# EAGLE design fullpcb (EAGLE 8.0.1)
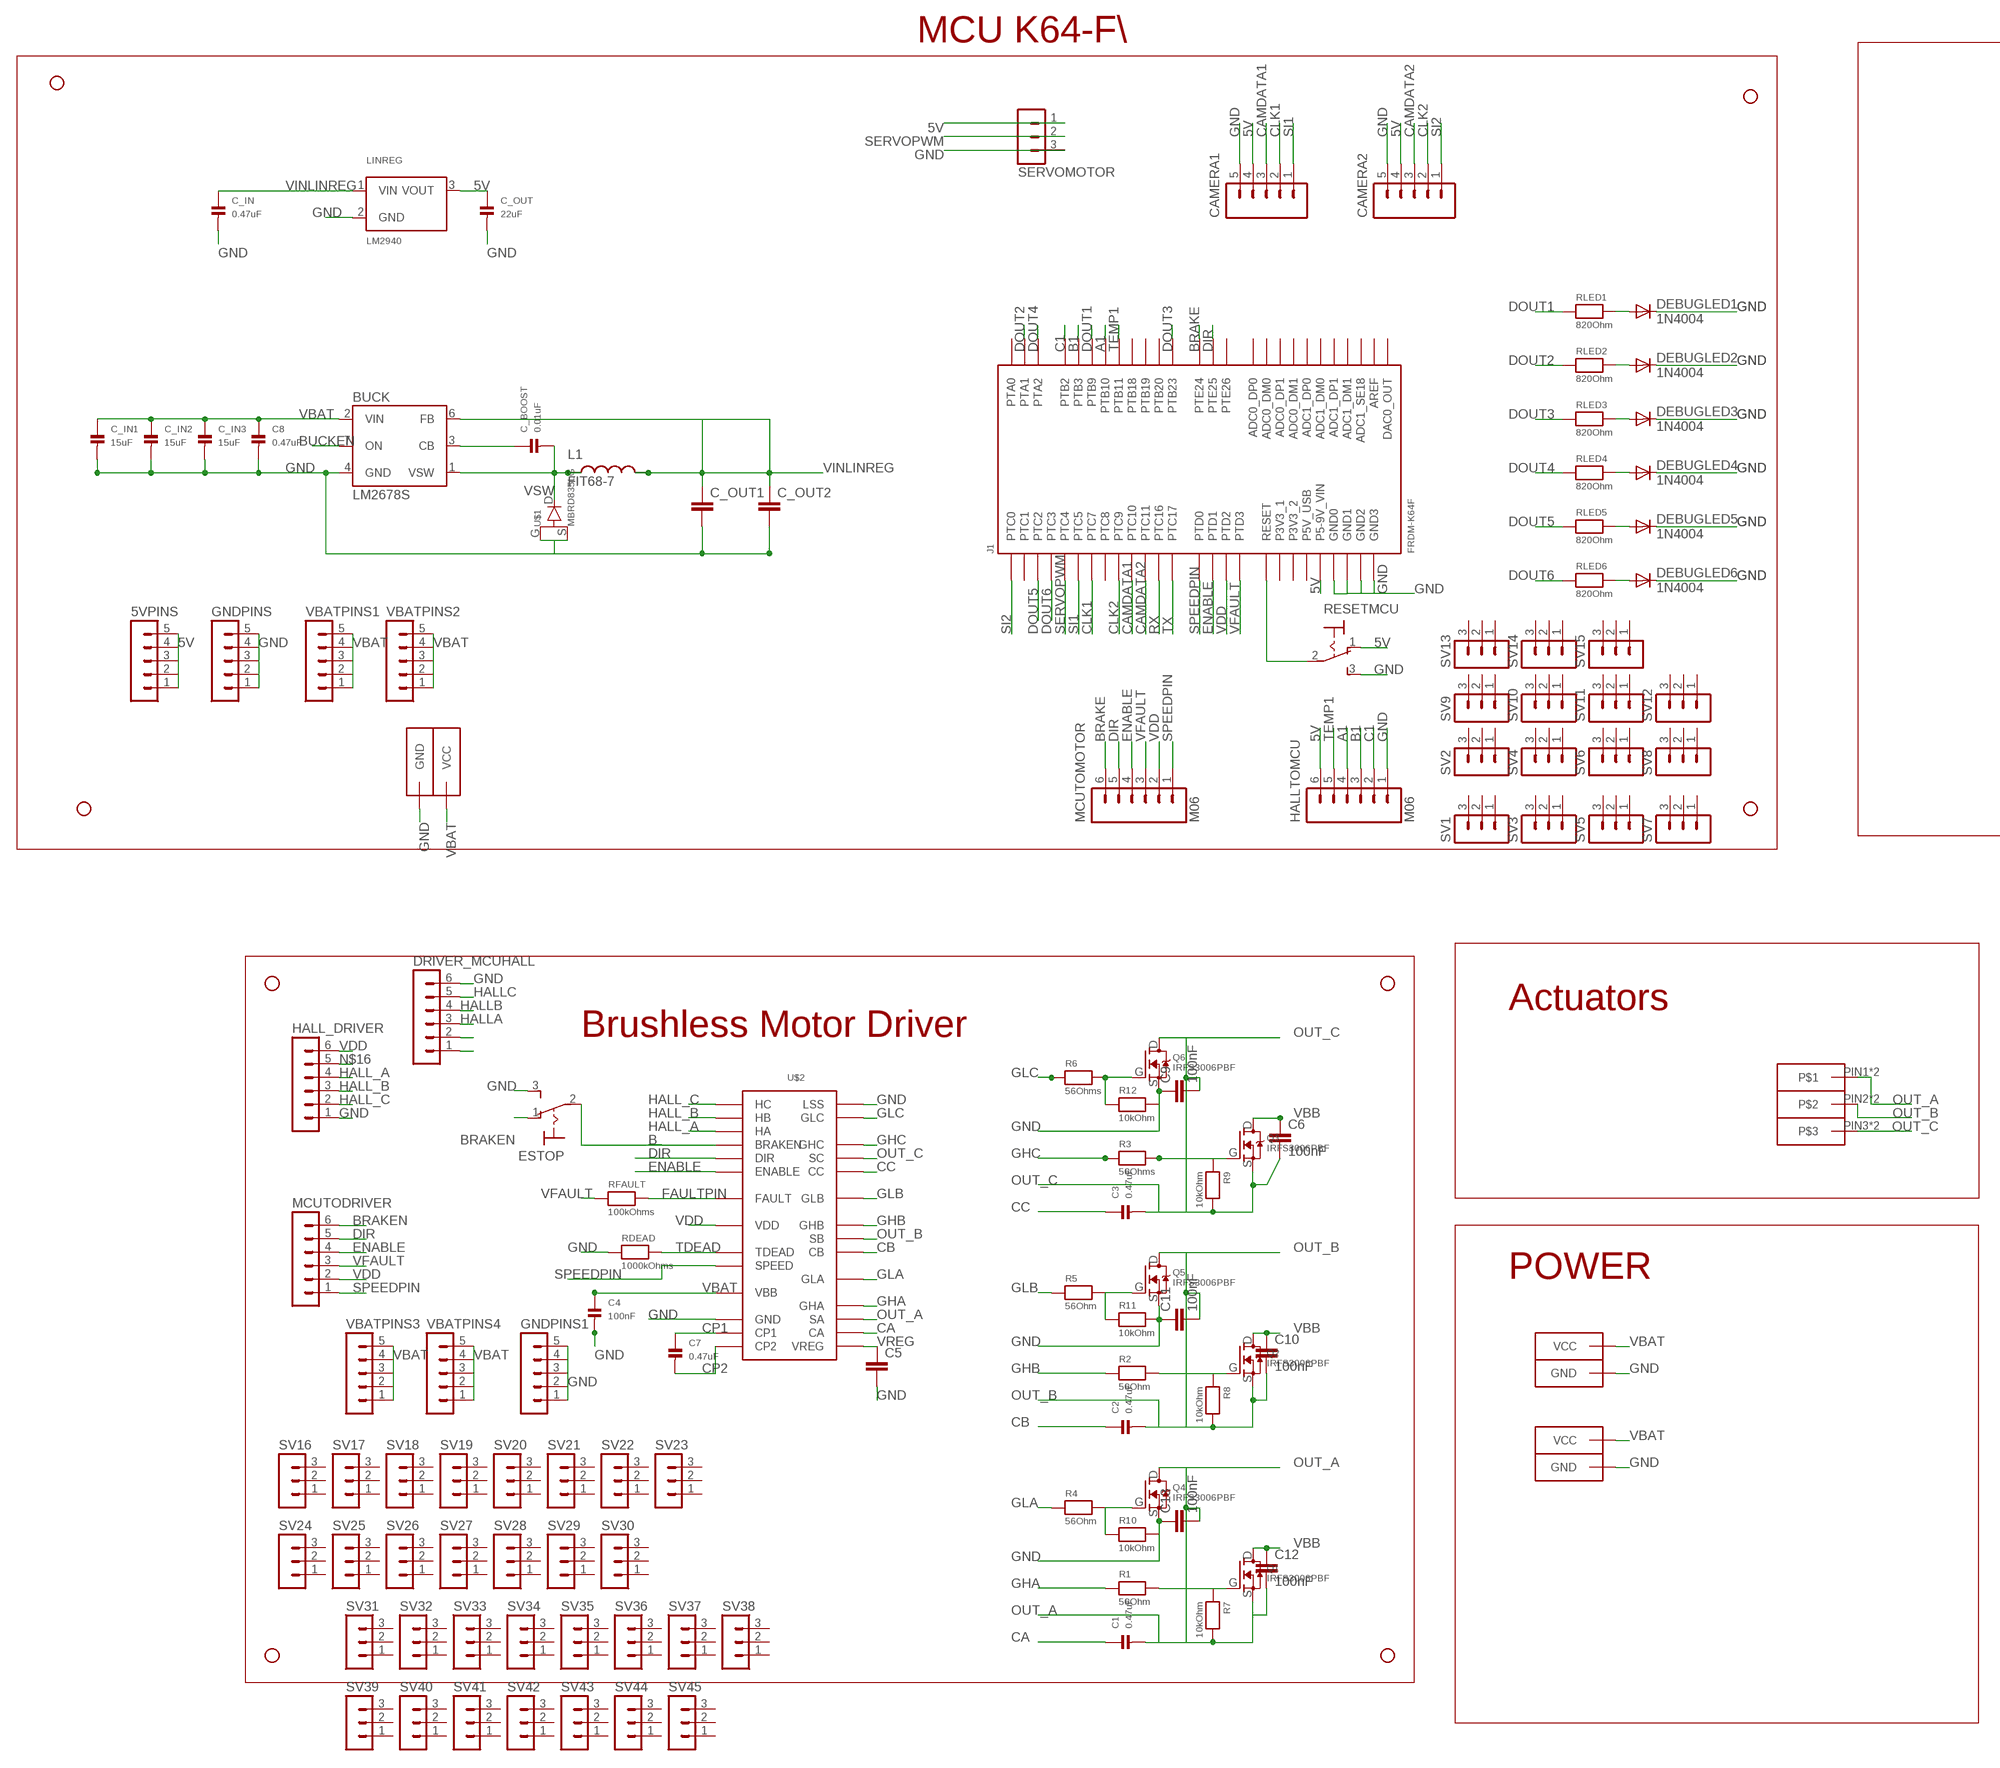
[diagram p0: schematic, sheet 1, part 1 of 2]
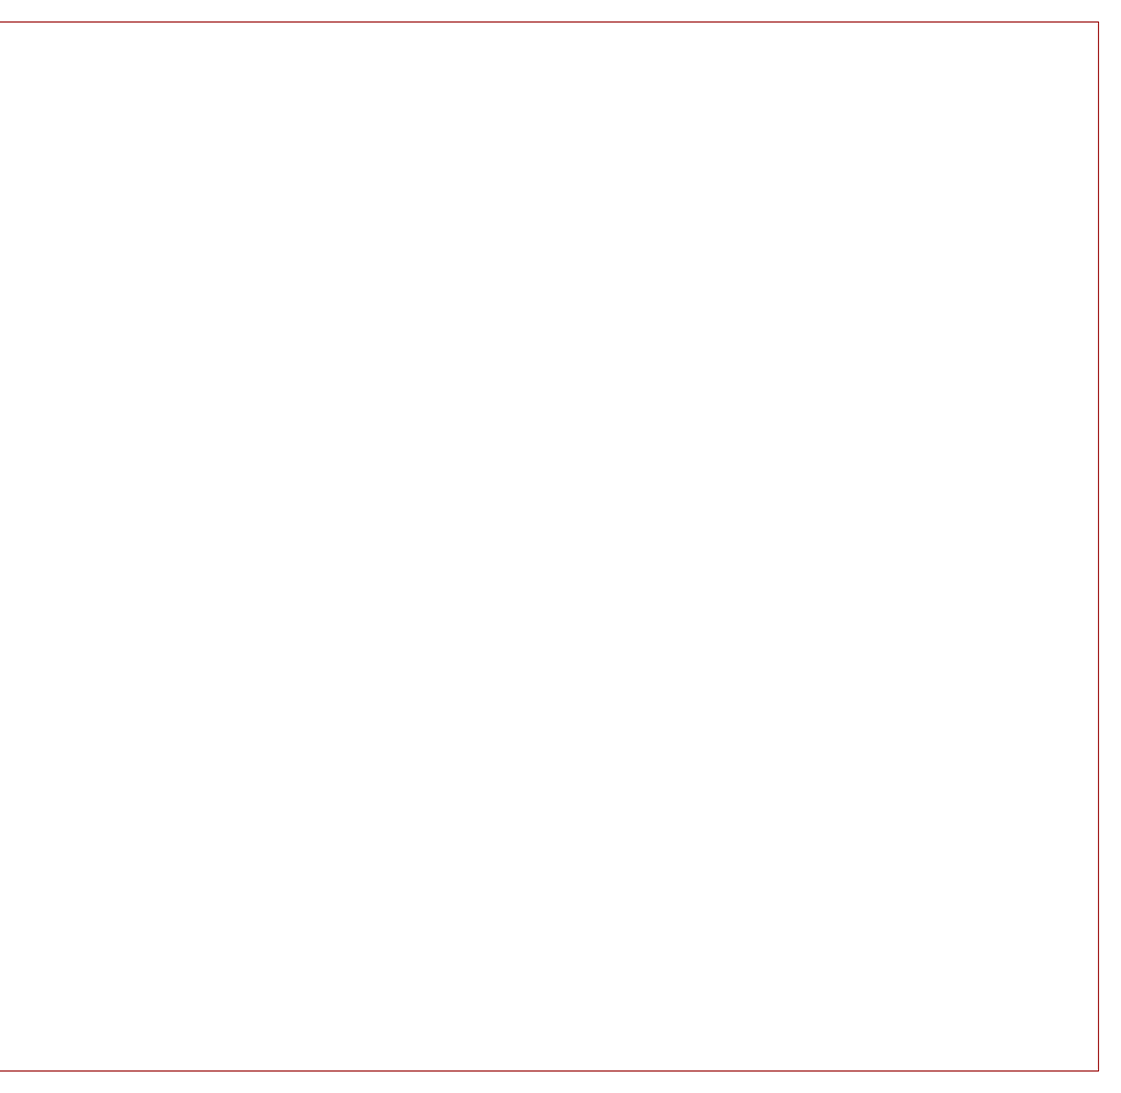
[diagram p1: schematic, sheet 1, part 2 of 2]

## Parts
5VPINS  MA05-1  [MA05-1]
BOARD2BOARD  ANDERSON_PP_DOUBLEHORIZONTAL  [ANDERSON_PP_DOUB_HORZ]
BUCK  LM2678S  [TO263-7]
C1  0.47uF  CAP_CERAMIC0805  [0805]
C2  0.47uF  CAP_CERAMIC0805  [0805]
C3  0.47uF  CAP_CERAMIC0805  [0805]
C4  100nF  CAP_CERAMIC0805  [0805]
C5  C2,5-3  [C2.5-3]
C6  100nF  C2,5-3  [C2.5-3]
C7  0.47uF  CAP_CERAMIC0805  [0805]
C8  0.47uF  CAP_CERAMIC0805  [0805]
C9  100nF  C2,5-3  [C2.5-3]
C10  100nF  C2,5-3  [C2.5-3]
C11  100nF  C2,5-3  [C2.5-3]
C12  100nF  C2,5-3  [C2.5-3]
C13  100nF  C2,5-3  [C2.5-3]
C_BOOST  0.01uF  CAP_CERAMIC0805  [0805]
C_IN  0.47uF  CAP_CERAMIC0805  [0805]
C_IN1  15uF  CAP_CERAMIC0805  [0805]
C_IN2  15uF  CAP_CERAMIC0805  [0805]
C_IN3  15uF  CAP_CERAMIC0805  [0805]
C_OUT  22uF  CAP_CERAMIC0805  [0805]
C_OUT1  C2,5-3  [C2.5-3]
C_OUT2  C2,5-3  [C2.5-3]
CAMERA1  M05PTH  [1X05]
CAMERA2  M05PTH  [1X05]
CONN1  ANDERSON_PP_DOUBLEHORIZONTAL  [ANDERSON_PP_DOUB_HORZ]
CONN2  ANDERSON_PP_DOUBLEHORIZONTAL  [ANDERSON_PP_DOUB_HORZ]
CONN3  ANDERSON_PP_TRIPHORIZ  [ANDERSON_PP_TRIP_HORZ]
DEBUGLED1  1N4004  [DO41-10]
DEBUGLED2  1N4004  [DO41-10]
DEBUGLED3  1N4004  [DO41-10]
DEBUGLED4  1N4004  [DO41-10]
DEBUGLED5  1N4004  [DO41-10]
DEBUGLED6  1N4004  [DO41-10]
DRIVER_MCUHALL  MA06-1  [MA06-1]
ESTOP  M9040P  [M9040P]
GNDPINS  MA05-1  [MA05-1]
GNDPINS1  MA05-1  [MA05-1]
HALL_DRIVER  MA06-1  [MA06-1]
HALLTOMCU  M06  [1X06-MTA]
J1  FRDM-K64F  [FRDM-K64F]
JP1  STAND-OFF  [STAND-OFF]
JP2  STAND-OFF  [STAND-OFF]
JP3  STAND-OFF  [STAND-OFF]
JP4  STAND-OFF  [STAND-OFF]
JP5  STAND-OFF  [STAND-OFF]
JP6  STAND-OFF  [STAND-OFF]
JP7  STAND-OFF  [STAND-OFF]
JP8  STAND-OFF  [STAND-OFF]
L1  FIT68-7  [FIT68-7]
LINREG  LM2940  [TO220V]
MCUTODRIVER  MA06-1  [MA06-1]
MCUTOMOTOR  M06  [1X06-MTA]
Q1  IRFS3006PBF  [IRFS3006PBF]
Q2  IRFS3006PBF  [IRFS3006PBF]
Q3  IRFS3006PBF  [IRFS3006PBF]
Q4  IRFS3006PBF  [IRFS3006PBF]
Q5  IRFS3006PBF  [IRFS3006PBF]
Q6  IRFS3006PBF  [IRFS3006PBF]
R1  56Ohm  RESISTOR0805  [0805]
R2  56Ohm  RESISTOR0805  [0805]
R3  56Ohms  RESISTOR0805  [0805]
R4  56Ohm  RESISTOR0805  [0805]
R5  56Ohm  RESISTOR0805  [0805]
R6  56Ohms  RESISTOR0805  [0805]
R7  10kOhm  RESISTOR0805  [0805]
R8  10kOhm  RESISTOR0805  [0805]
R9  10kOhm  RESISTOR0805  [0805]
R10  10kOhm  RESISTOR0805  [0805]
R11  10kOhm  RESISTOR0805  [0805]
R12  10kOhm  RESISTOR0805  [0805]
RDEAD  1000kOhms  RESISTOR0805  [0805]
RESETMCU  M9040P  [M9040P]
RFAULT  100kOhms  RESISTOR0805  [0805]
RLED1  820Ohm  RESISTOR0805  [0805]
RLED2  820Ohm  RESISTOR0805  [0805]
RLED3  820Ohm  RESISTOR0805  [0805]
RLED4  820Ohm  RESISTOR0805  [0805]
RLED5  820Ohm  RESISTOR0805  [0805]
RLED6  820Ohm  RESISTOR0805  [0805]
SERVOMOTOR  MA03-1  [MA03-1]
SV1  MA03-1  [MA03-1]
SV2  MA03-1  [MA03-1]
SV3  MA03-1  [MA03-1]
SV4  MA03-1  [MA03-1]
SV5  MA03-1  [MA03-1]
SV6  MA03-1  [MA03-1]
SV7  MA03-1  [MA03-1]
SV8  MA03-1  [MA03-1]
SV9  MA03-1  [MA03-1]
SV10  MA03-1  [MA03-1]
SV11  MA03-1  [MA03-1]
SV12  MA03-1  [MA03-1]
SV13  MA03-1  [MA03-1]
SV14  MA03-1  [MA03-1]
SV15  MA03-1  [MA03-1]
SV16  MA03-1  [MA03-1]
SV17  MA03-1  [MA03-1]
SV18  MA03-1  [MA03-1]
SV19  MA03-1  [MA03-1]
SV20  MA03-1  [MA03-1]
SV21  MA03-1  [MA03-1]
SV22  MA03-1  [MA03-1]
SV23  MA03-1  [MA03-1]
SV24  MA03-1  [MA03-1]
SV25  MA03-1  [MA03-1]
SV26  MA03-1  [MA03-1]
SV27  MA03-1  [MA03-1]
SV28  MA03-1  [MA03-1]
SV29  MA03-1  [MA03-1]
SV30  MA03-1  [MA03-1]
SV31  MA03-1  [MA03-1]
SV32  MA03-1  [MA03-1]
SV33  MA03-1  [MA03-1]
SV34  MA03-1  [MA03-1]
SV35  MA03-1  [MA03-1]
SV36  MA03-1  [MA03-1]
SV37  MA03-1  [MA03-1]
SV38  MA03-1  [MA03-1]
SV39  MA03-1  [MA03-1]
SV40  MA03-1  [MA03-1]
SV41  MA03-1  [MA03-1]
SV42  MA03-1  [MA03-1]
SV43  MA03-1  [MA03-1]
SV44  MA03-1  [MA03-1]
SV45  MA03-1  [MA03-1]
U$1  MBRD835LG  [DPACK_2]
U$2  A4915SOCKET  [DIL28-6]
VBATPINS1  MA05-1  [MA05-1]
VBATPINS2  MA05-1  [MA05-1]
VBATPINS3  MA05-1  [MA05-1]
VBATPINS4  MA05-1  [MA05-1]

## Nets
5V: 5VPINS.1 5VPINS.5 C_OUT.1 CAMERA1.4 CAMERA2.4 HALLTOMCU.6 J1.J3-16(P5-9V_VIN) LINREG.3(VOUT) RESETMCU.1(O) SERVOMOTOR.1
A1: HALLTOMCU.4 J1.J4-6(PTB10)
B1: HALLTOMCU.3 J1.J4-4(PTB3)
BRAKE: J1.J2-20(PTE24) MCUTOMOTOR.6
BRAKE1: ESTOP.2(P) U$2.25(BRAKEN)
BRAKEN: ESTOP.1(O) MCUTODRIVER.6
BUCKEN: BUCK.7(ON)
C1: HALLTOMCU.2 J1.J4-2(PTB2)
CA: C1.1 U$2.13(CA)
CAMDATA1: CAMERA1.3 J1.J4-12(PTC10)
CAMDATA2: CAMERA2.3 J1.J4-10(PTC11)
CB: BUCK.3(CB) C2.1 C_BOOST.1 U$2.9(CB)
CC: C3.1 U$2.5(CC)
CLK1: CAMERA1.2 J1.J1-13(PTC7)
CLK2: CAMERA2.2 J1.J1-9(PTC9)
CP1: C7.1 U$2.16(CP1)
CP2: C7.2 U$2.15(CP2)
DIR: J1.J2-18(PTE25) MCUTODRIVER.5 MCUTOMOTOR.5 U$2.24(DIR)
DOUT1: J1.J1-6(PTB9) RLED1.1
DOUT2: J1.J1-8(PTA1) RLED2.1
DOUT3: J1.J1-10(PTB23) RLED3.1
DOUT4: J1.J1-12(PTA2) RLED4.1
DOUT5: J1.J1-14(PTC2) RLED5.1
DOUT6: J1.J1-16(PTC3) RLED6.1
ENABLE: J1.J2-12(PTD1) MCUTODRIVER.4 MCUTOMOTOR.4 U$2.23(ENABLE)
FAULTPIN: RFAULT.2 U$2.22(FAULT)
GHA: R1.1 U$2.11(GHA)
GHB: R2.1 U$2.7(GHB)
GHC: R3.1 U$2.3(GHC)
GLA: R4.1 U$2.10(GLA)
GLB: R5.1 U$2.6(GLB)
GLC: R6.1 U$2.2(GLC)
GND: BOARD2BOARD.PIN1(GND) BOARD2BOARD.PIN1-LEAD(GND) BUCK.4(GND) C4.2 C5.2 C8.2 C9.1 C11.1 C13.1 C_IN1.2 C_IN2.2 C_IN3.2 C_IN.2 C_OUT1.2 C_OUT2.2 C_OUT.2 CAMERA1.5 CAMERA2.5 CONN1.PIN1(GND) CONN1.PIN1-LEAD(GND) CONN2.PIN1(GND) CONN2.PIN1-LEAD(GND) DEBUGLED1.C DEBUGLED2.C DEBUGLED3.C DEBUGLED4.C DEBUGLED5.C DEBUGLED6.C DRIVER_MCUHALL.6 ESTOP.3(S) GNDPINS1.1 GNDPINS1.5 GNDPINS.1 GNDPINS.5 HALL_DRIVER.1 HALLTOMCU.1 J1.J2-3(GND0) J1.J2-14(GND1) J1.J3-12(GND2) J1.J3-14(GND3) LINREG.2(GND) Q4.S Q5.S Q6.S R10.2 R11.2 R12.2 RESETMCU.3(S) SERVOMOTOR.3 U$1.G U$1.S U$2.1(LSS) U$2.17(GND)
HALL_A: HALL_DRIVER.4 U$2.26(HA)
HALL_B: HALL_DRIVER.3 U$2.27(HB)
HALL_C: HALL_DRIVER.2 U$2.28(HC)
HALLA: DRIVER_MCUHALL.3
HALLB: DRIVER_MCUHALL.4
HALLC: DRIVER_MCUHALL.5
N$1: DEBUGLED2.A RLED2.2
N$2: DEBUGLED3.A RLED3.2
N$3: DEBUGLED4.A RLED4.2
N$4: DEBUGLED5.A RLED5.2
N$5: DEBUGLED6.A RLED6.2
N$6: J1.J3-6(RESET) RESETMCU.2(P)
N$7: DEBUGLED1.A RLED1.2
N$8: Q1.G R1.2 R7.1
N$9: Q4.G R4.2 R10.1
N$11: Q2.G R2.2 R8.1
N$12: Q5.G R5.2 R11.1
N$14: Q6.G R6.2 R12.1
N$15: Q3.G R3.2 R9.1
N$16: HALL_DRIVER.5
N$25: DRIVER_MCUHALL.2
N$26: DRIVER_MCUHALL.1
OUT_A: C1.2 C12.2 C13.2 CONN3.PIN1 CONN3.PIN1-LEAD Q1.S Q4.D R7.2 U$2.12(SA)
OUT_B: C2.2 C10.2 C11.2 CONN3.PIN2 CONN3.PIN2-LEAD Q2.S Q5.D R8.2 U$2.8(SB)
OUT_C: C3.2 C6.2 C9.2 CONN3.PIN3 CONN3.PIN3-LEAD Q3.S Q6.D R9.2 U$2.4(SC)
RX: J1.J1-2(PTC16)
SERVOPWM: J1.J2-4(PTC4) SERVOMOTOR.2
SI1: CAMERA1.1 J1.J1-15(PTC5)
SI2: CAMERA2.1 J1.J1-11(PTC0)
SPEEDPIN: J1.J2-6(PTD0) MCUTODRIVER.1 MCUTOMOTOR.1 U$2.19(SPEED)
TDEAD: U$2.20(TDEAD)
TEMP1: HALLTOMCU.5 J1.J4-8(PTB11)
TX: J1.J1-4(PTC17)
VBAT: BOARD2BOARD.PIN2(VCC) BOARD2BOARD.PIN2-LEAD(VCC) BUCK.2(VIN) C4.1 C8.1 C_IN1.1 C_IN2.1 C_IN3.1 CONN1.PIN2(VCC) CONN1.PIN2-LEAD(VCC) CONN2.PIN2(VCC) CONN2.PIN2-LEAD(VCC) U$2.18(VBB) VBATPINS1.1 VBATPINS1.5 VBATPINS2.1 VBATPINS2.5 VBATPINS3.1 VBATPINS3.5 VBATPINS4.1 VBATPINS4.5
VBB: C6.1 C10.1 C12.1 Q1.D Q2.D Q3.D
VDD: HALL_DRIVER.6 J1.J2-8(PTD2) MCUTODRIVER.2 MCUTOMOTOR.2 U$2.21(VDD)
VFAULT: J1.J2-10(PTD3) MCUTODRIVER.3 MCUTOMOTOR.3 RFAULT.1
VINLINREG: BUCK.6(FB) C_IN.1 C_OUT1.1 C_OUT2.1 L1.P$2 LINREG.1(VIN)
VREG: C5.1 U$2.14(VREG)
VSW: BUCK.1(VSW) C_BOOST.2 L1.P$1
Unconnected: 5VPINS.2 5VPINS.3 5VPINS.4 GNDPINS1.2 GNDPINS1.3 GNDPINS1.4 GNDPINS.2 GNDPINS.3 GNDPINS.4 J1.J1-1(PTB18) J1.J1-3(PTB19) J1.J1-5(PTC1) J1.J1-7(PTC8) J1.J2-1(PTE26) J1.J2-2(PTA0) J1.J2-5(ADC0_DP0) J1.J2-7(ADC0_DM0) J1.J2-11(ADC1_DP0) J1.J2-13(ADC1_DM0) J1.J2-16(AREF) J1.J2-17(ADC1_SE18) J1.J3-4(P3V3_1) J1.J3-8(P3V3_2) J1.J3-10(P5V_USB) J1.J4-1(ADC0_DP1) J1.J4-3(ADC0_DM1) J1.J4-5(ADC1_DP1) J1.J4-7(ADC1_DM1) J1.J4-9(PTB20) J1.J4-11(DAC0_OUT) RDEAD.1 RDEAD.2 SV1.1 SV1.2 SV1.3 SV2.1 SV2.2 SV2.3 SV3.1 SV3.2 SV3.3 SV4.1 SV4.2 SV4.3 SV5.1 SV5.2 SV5.3 SV6.1 SV6.2 SV6.3 SV7.1 SV7.2 SV7.3 SV8.1 SV8.2 SV8.3 SV9.1 SV9.2 SV9.3 SV10.1 SV10.2 SV10.3 SV11.1 SV11.2 SV11.3 SV12.1 SV12.2 SV12.3 SV13.1 SV13.2 SV13.3 SV14.1 SV14.2 SV14.3 SV15.1 SV15.2 SV15.3 SV16.1 SV16.2 SV16.3 SV17.1 SV17.2 SV17.3 SV18.1 SV18.2 SV18.3 SV19.1 SV19.2 SV19.3 SV20.1 SV20.2 SV20.3 SV21.1 SV21.2 SV21.3 SV22.1 SV22.2 SV22.3 SV23.1 SV23.2 SV23.3 SV24.1 SV24.2 SV24.3 SV25.1 SV25.2 SV25.3 SV26.1 SV26.2 SV26.3 SV27.1 SV27.2 SV27.3 SV28.1 SV28.2 SV28.3 SV29.1 SV29.2 SV29.3 SV30.1 SV30.2 SV30.3 SV31.1 SV31.2 SV31.3 SV32.1 SV32.2 SV32.3 SV33.1 SV33.2 SV33.3 SV34.1 SV34.2 SV34.3 SV35.1 SV35.2 SV35.3 SV36.1 SV36.2 SV36.3 SV37.1 SV37.2 SV37.3 SV38.1 SV38.2 SV38.3 SV39.1 SV39.2 SV39.3 SV40.1 SV40.2 SV40.3 SV41.1 SV41.2 SV41.3 SV42.1 SV42.2 SV42.3 SV43.1 SV43.2 SV43.3 SV44.1 SV44.2 SV44.3 SV45.1 SV45.2 SV45.3 U$1.D VBATPINS1.2 VBATPINS1.3 VBATPINS1.4 VBATPINS2.2 VBATPINS2.3 VBATPINS2.4 VBATPINS3.2 VBATPINS3.3 VBATPINS3.4 VBATPINS4.2 VBATPINS4.3 VBATPINS4.4

## Notes on the sheet
- MCU K64-F\
- Actuators
- Brushless Motor Driver
- POWER

## Library data of the parts
5VPINS GNDPINS GNDPINS1 VBATPINS1-VBATPINS4 = con-lstb:MA05-1: PIN HEADER; OC_FARNELL: unknown; OC_NEWARK: unknown
BOARD2BOARD CONN1 CONN2 = ee192:ANDERSON_PP_DOUBLE: 2-pin 25A Anderson Connector http://www.alliedelec.com/images/products/datasheets/bm/ANDERSON_POWER_PRODUCTS/70162018.pdf; PIE-INT-REF-NUM: Anderson
BUCK = v-reg-3:LM2678: National Semiconductor <http://www.national.com> 5.0A "Simple Switcher"(c) 260kHz, Vout 1.2-37V, Vin 40V, 120mOhm DMOS switch, 50µA standby current
C1-C4 C7 C8 C_BOOST C_IN C_IN1-C_IN3 C_OUT = microbuilder:CAP_CERAMIC: Ceramic Capacitors 0402 - 0402 Surface Mount Capacitors 16pF 50V 5% [Digikey: 445-4899-2-ND] 18pF 50V 5% [Digikey: 490-1281-2-ND] 22pF 50V 5% [Digikey: 490-1283-2-ND] 68pF 50V 5% [Digikey: 490-1289-2-ND] 0.1uF 10V 10% [Digikey: 490-1318-2-ND] 1.0uF 6.3V 10% [Digikey: 490-1320-2-ND] 0603 - 0603 Surface Mount Capacitors 16 pF 50V 5% [Digikey: 445-5051-2-ND] 22 pF 50V [Digikey: PCC220ACVTR-ND] 33 pF 50V 5% [Digikey: 490-1415-1-ND] 56pF 50V 5% [Digikey: 490-1421-1-ND] 220pF 50V 5% [Digikey: 445-1285-1-ND] 680 pF 50V 2200 pF 50V 5% C0G [Digikey: 445-1297-1-ND] 5600 pF 100V 5% X7R [Digikey: 478-3711-1-ND] 0.1 µF 25V 10% [Digikey: PCC2277TR-ND] 0.22 µF 16V 10% X7R [Digikey: 445-1318-1-ND] 1.0 µF 25V 10% [Digikey: 445-5146-2-ND] 0603 - RF Specific 3pF 250V +/-0.1pF RF [Digikey: 712-1347-1-ND] 18 pF 250V 5% [Digikey: 478-3505-1-ND or 712-1322-1-ND] 56 pF 250V 5% C0G RF [Digikey: 490-4867-1-ND] 68 pF 250V RF [Digikey: 490-4868-1-ND] 0805 - 0805 Surface Mount Capacitors 220 pF 250V 2% RF Ceramic Capacitor [Digikey: 712-1398-1-ND] 1000 pF 50V 2% NP0 Ceramic Capacitor [Digikey: 478-3760-1-ND] 0.1 µF 25V 10% Ceramic Capacitor [Digikey: PCC1828TR-ND] 1.0 µF 16V 10% Ceramic Capacitor[Digikey: 490-1691-2-ND] 10.0 µF 10V 10% Ceramic Capacitor[Digikey: 709-1228-1-ND] 10.0 uF 16V 10% Ceramic Capacitor [Digikey: 478-5165-2-ND] 47 uF 6.3V 20% Ceramic Capacitor [Digikey: 587-1779-1-ND or 399-5506-1-ND] 1206 - 1206 Surface Mount Capacitors 47uF 10V 20% Ceramic Capacitor [Digikey: 490-5528-1-ND or 399-5508-1-ND or 445-6010-1-ND] 100uF 6.3V -20%, +80% Y5V Ceramic Capacitor (Digikey: 490-4512-1-ND, Mouser: 81-GRM31CF50J107ZE1L)
C5 C6 C9-C13 C_OUT1 C_OUT2 = capacitor-wima:C: CAPACITOR naming: grid - package width
CAMERA1 CAMERA2 = ee192:M05: 5-pin 0.1-inch header and MTA connector Courtsey of Pioneers in Engineering; PIE-INT-REF-NUM: BULK-STOCK
CONN3 = ee192:ANDERSON_PP_TRIP: 3-pin 25A Anderson Connector http://www.alliedelec.com/images/products/datasheets/bm/ANDERSON_POWER_PRODUCTS/70162018.pdf
DEBUGLED1-DEBUGLED6 = diode:1N4004: DIODE general purpose rectifier, 1 A
DRIVER_MCUHALL HALL_DRIVER MCUTODRIVER = con-lstb:MA06-1: PIN HEADER; OC_FARNELL: unknown; OC_NEWARK: unknown
ESTOP RESETMCU = switch:M9040P: TOGGLE SWITCH Marquardt
HALLTOMCU MCUTOMOTOR = ee192:M06: 6-pin 0.1-inch MTA connector Courtsey of Pioneers in Engineering; PIE-INT-REF-NUM: MTA
J1 = ee192:FRDM-K64F: Shield for Freescale Freedom board FRDM-K64F by nathan wong, Team 7 Sp 2016
JP1-JP8 = ee192:STAND-OFF: Stand Off This is the mechanical footprint for a #4 phillips button head screw. Use the keepout ring to avoid running the screw head into surrounding components. SKU : PRT-00447
L1 = ee192:FIT68-7: FIT68-7 Switchmode/High Frequency Toroidal Inductor
LINREG = ee192:LM2940
Q1-Q6 = ee192:IRFS3006PBF
R1-R12 RDEAD RFAULT RLED1-RLED6 = microbuilder:RESISTOR: Resistors 0402 - 0402 Surface Mount Package 22 Ohm 1% 1/16W [Digikey: 311-22.0LRTR-ND] 33 Ohm 5% 1/16W 1.0K 5% 1/16W 1.5K 5% 1/16W 2.0K 1% 1/16W 10.0K 1% 1/16W [Digikey: 311-10.0KLRTR-ND] 10.0K 5% 1/16W [Digikey: RMCF0402JT10K0TR-ND] 12.1K 1% 1/16W [Digikey: 311-22.0LRTR-ND] 100.0K 5% 1/16W 0603 - 0603 Surface Mount Package 0 Ohm 1/10 Watt 1% Resistor 15 Ohm 1/10 Watt 1% Resistor 33 Ohm 1/10 Watt 1% Resistor 49.9 Ohm 1/10 Watt 1% Resistor 100 Ohm 1/10 Watt 1% Resistor 150 Ohm 1/10 Watt 1% Resistor 240 Ohm 1/10 Watt 1% Resistor 390 Ohm 1/10 Watt 1% Resistor 560 Ohm 1/10 Watt 1% Resistor 680 Ohm 1/10 Watt 1% Resistor 750 Ohm 1/10 Watt 1% Resistor 1.0K Ohm 1/10 Watt 1% Resistor 1.5K Ohm 1/10 Watt 1% Resistor 2.0K Ohm 1/10 Watt 1% Resistor 2.2K Ohm 1/10 Watt 1% Resistor 3.3K Ohm 1/10 Watt 1% Resistor 4.7K Ohm 1/10 Watt 1% Resistor 10.0K Ohm 1/10 Watt 1% Resistor 12.0K Ohm 1/10 Watt 1% Resistor 12.1K Ohm 1/10 Watt 1% Resistor 20.0K Ohm 1/10 Watt 1% Resistor 33.0K Ohm 1/10 Watt 1% Resistor 100.0K Ohm 1/10 Watt 1% Resistor 0805 - 0805 Surface Mount Package 0 Ohm 1/8 Watt 1% Resistor 33 Ohm 1/8 Watt 1% Resistor 100 Ohm 1/8 Watt 1% Resistor 150 Ohm 1/8 Watt 1% Resistor 200 Ohm 1/8 Watt 1% Resistor 240 Ohm 1/8 Watt 1% Resistor 330 Ohm 1/8 Watt 1% Resistor 390 Ohm 1/8 Watt 1% Resistor 470 Ohm 1/8 Watt 1% Resistor 1.0K Ohm 1/8 Watt 1% Resistor 1.5K Ohm 1/8 Watt 1% Resistor 2.0K Ohm 1/8 Watt 1% Resistor 4.7K Ohm 1/8 Watt 1% Resistor 5.1K Ohm 1/8 Watt 1% Resistor 5.6K Ohm 1/8 Watt 1% Resistor 10.0K Ohm 1/8 Watt 1% Resistor 22.0K Ohm 1/8 Watt 1% Resistor 33.0K Ohm 1/8 Watt 1% Resistor 100K Ohm 1/8 Watt 1% Resistor 1206 - 1206 Surface Mount Package 2012 - 2010 Surface Mount Package 0.11 Ohm 1/2 Watt 1% Resistor - Digikey: RHM.11UCT-ND
SERVOMOTOR SV1-SV45 = con-lstb:MA03-1: PIN HEADER; OC_FARNELL: unknown; OC_NEWARK: unknown
U$1 = ee192:MBRD835LG
U$2 = ee192motordriver:A4915: 3-Phase MOSFET Driver

## Module 5V_SERVO
Ports: VBAT(io) GND(io)

### Library data of the parts

## Board
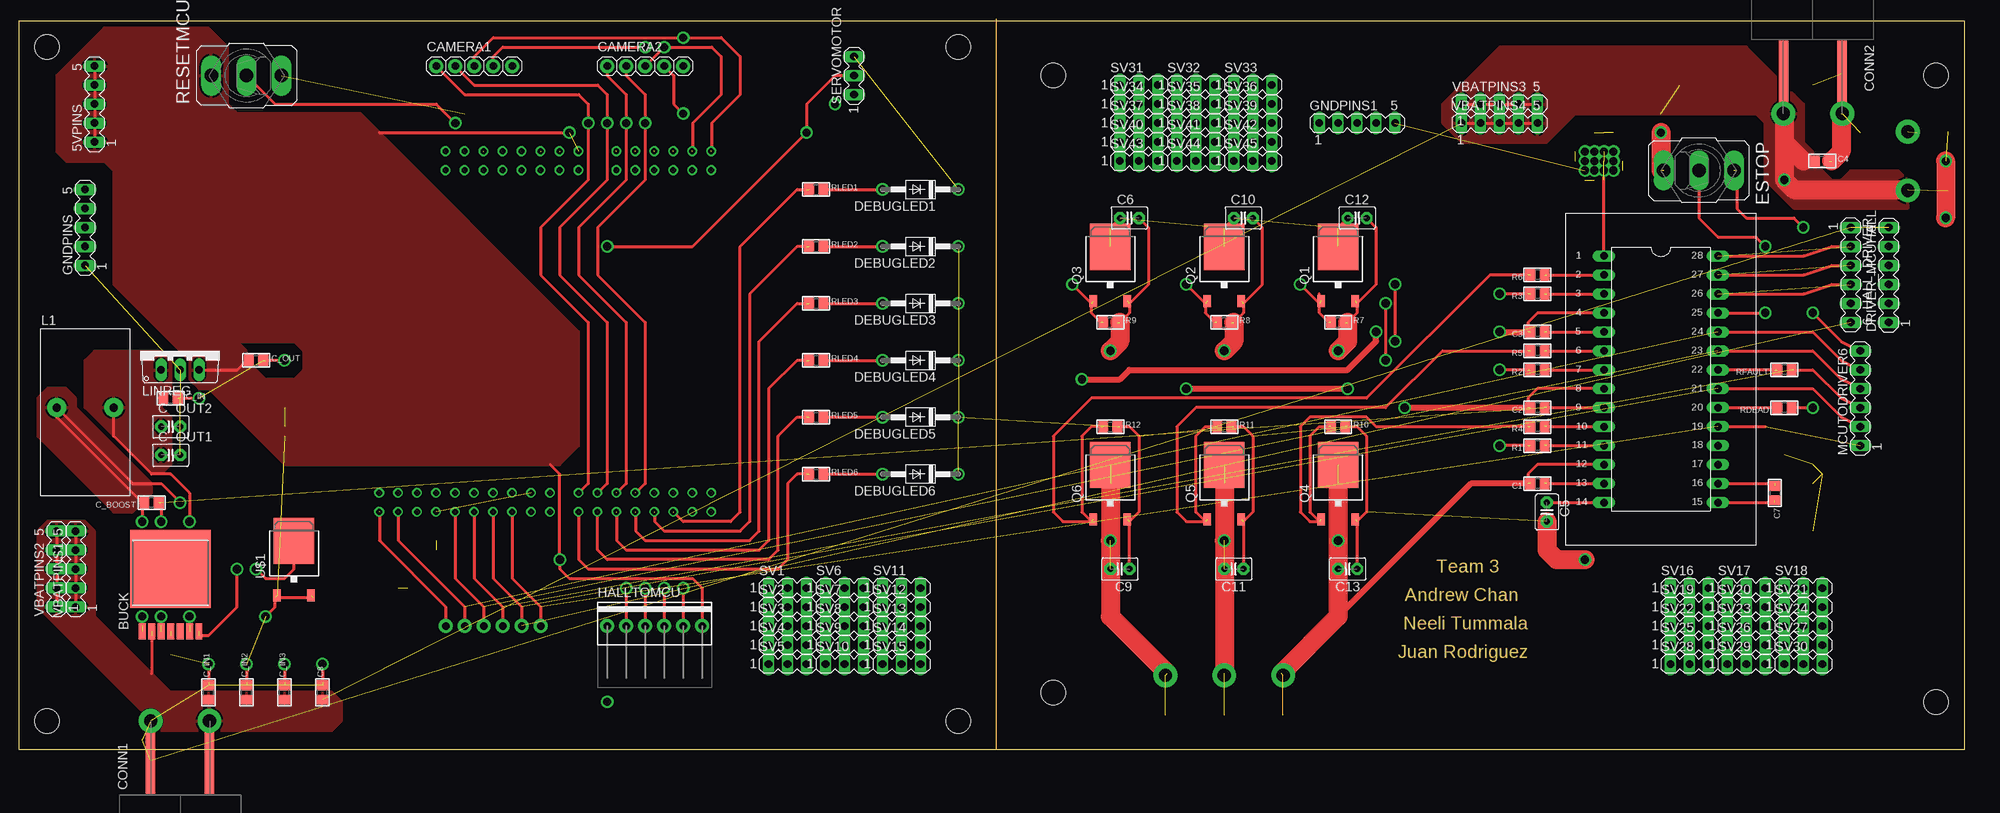
[diagram p2: board, top side]
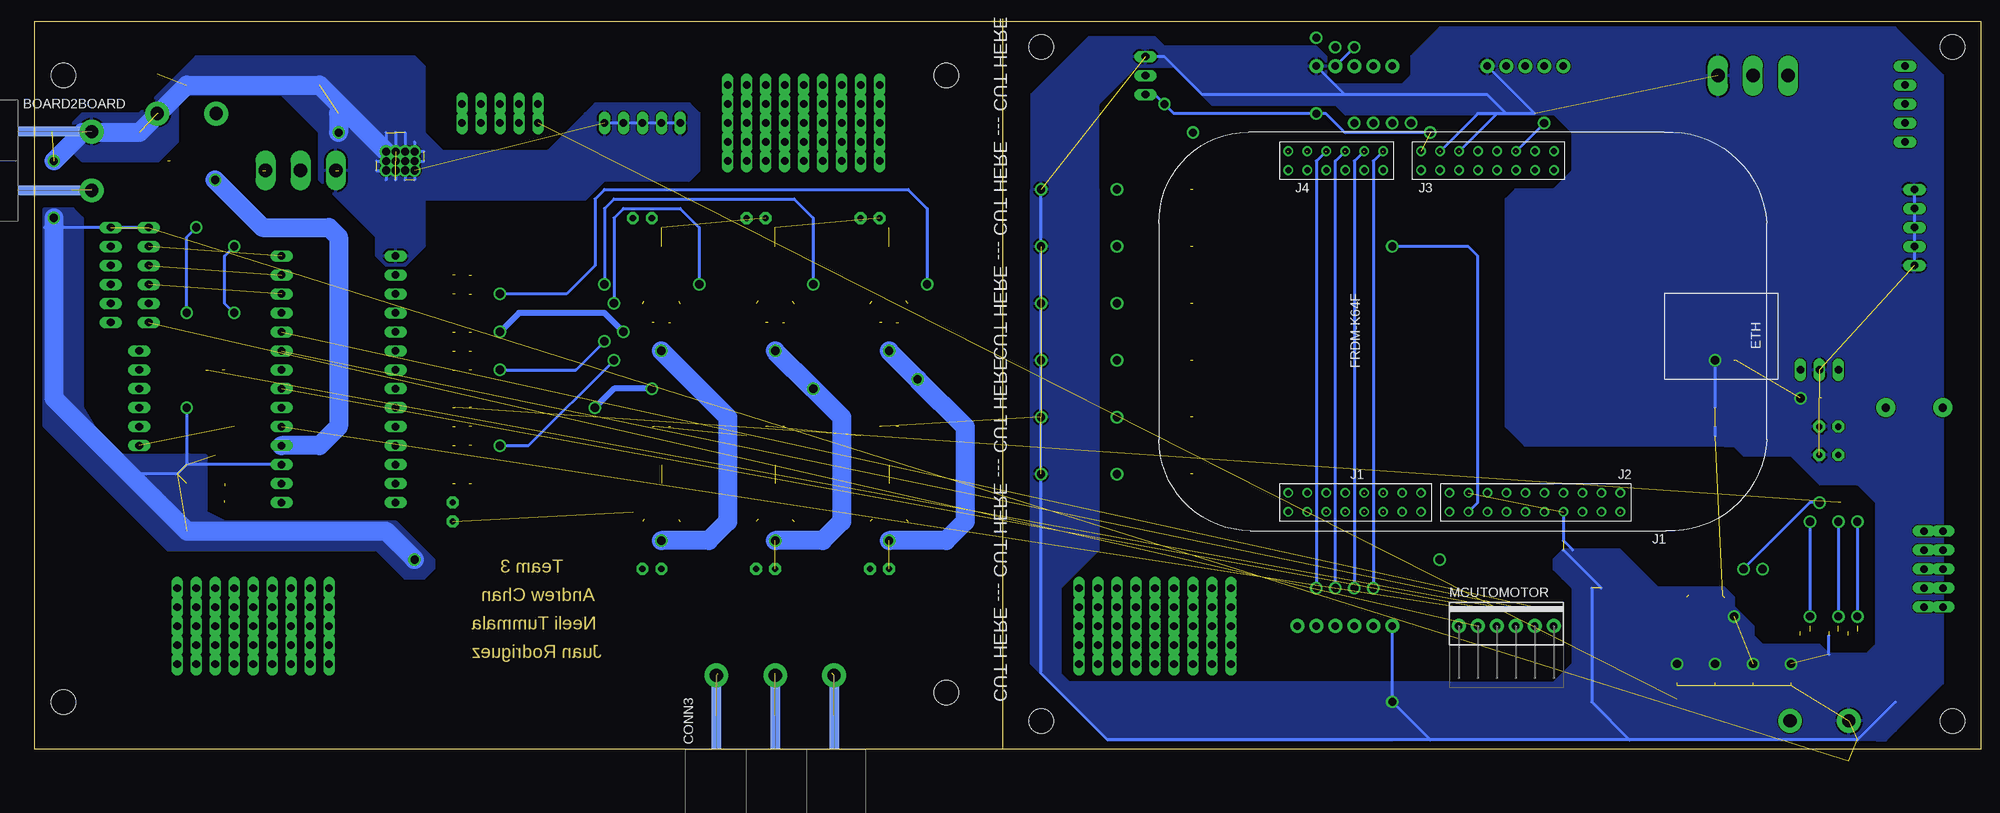
[diagram p3: board, bottom side, seen from below]

Size 260.33 x 97.79 mm. Coordinates in mm from the lower left corner, seen from the top.
Outline: 130.81,0 0,0 0,97.46 260.33,97.46 260.33,0 130.81,0
Outline: 130.81,0 130.81,97.79
Copper layers (1*16): Top 0.035mm / dielectric 1.5mm / Bottom 0.035mm
Design rules "BAC_Rules": minimum track width 10mil, minimum drill 10mil, track to track 5mil, track to pad 8mil, pad to pad 8mil, via to via 8mil, smd to smd 8mil, copper to edge 10mil, drill to drill 8mil, minimum pad ring 10mil, minimum via ring 8mil, stop-mask expansion 4mil, vias tented up to drill 0mil, thermal gap 10mil

### Footprints (pad centres in the part's own frame; a part is rotated, then mirrored left to right if it is on the bottom)
MA05-1 = drill 1.016 long: 1 -5.08,0; 2 -2.54,0; 3 0,0; 4 2.54,0; 5 5.08,0
ANDERSON_PP_DOUB_HORZ = drill 1.778 pad 3.175: PIN1 0,3.937; PIN2 0,-3.937 | smd 8.89 x 1.27: PIN1-LEAD -5.334,3.937; PIN2-LEAD -5.334,-3.937
TO263-7 = smd 0.91 x 2.16: 1 -3.81,-5.78; 2 -2.54,-5.78; 3 -1.27,-5.78; 4 0,-5.78; 5 1.27,-5.78; 6 2.54,-5.78; 7 3.81,-5.78 | smd 10.8 x 10.41: 8 0,2.54
0805 = smd 1.3 x 1.5: 1 -0.95,0; 2 0.95,0
C2.5-3 = drill 0.813 pad 1.6 octagon: 1 -1.27,0; 2 1.27,0
1X05 = drill 1.016 pad 1.88: 1 -5.08,0; 2 -2.54,0; 3 0,0; 4 2.54,0; 5 5.08,0
ANDERSON_PP_TRIP_HORZ = drill 1.778 pad 3.175: PIN1 9.906,7.874; PIN2 9.906,0; PIN3 9.906,-7.874 | smd 8.89 x 1.27: PIN1-LEAD 4.572,7.874; PIN2-LEAD 4.572,0; PIN3-LEAD 4.572,-7.874
DO41-10 = drill 1.118: A 5.08,0; C -5.08,0
MA06-1 = drill 1.016 long: 1 -6.35,0; 2 -3.81,0; 3 -1.27,0; 4 1.27,0; 5 3.81,0; 6 6.35,0
M9040P = drill 1.803 long: 1 0,4.699; 2 0,0; 3 0,-4.699
1X06-MTA = drill 1.016 pad 1.88: 1 -6.35,0; 2 -3.81,0; 3 -1.27,0; 4 1.27,0; 5 3.81,0; 6 6.35,0
FRDM-K64F = drill 0.8: J1-1 23.622,21.59; J1-2 23.622,24.13; J1-3 21.082,21.59; J1-4 21.082,24.13; J1-5 18.542,21.59; J1-6 18.542,24.13; J1-7 16.002,21.59; J1-8 16.002,24.13; J1-9 13.462,21.59; J1-10 13.462,24.13; J1-11 10.922,21.59; J1-12 10.922,24.13; J1-13 8.382,21.59; J1-14 8.382,24.13; J1-15 5.842,21.59; J1-16 5.842,24.13; J2-1 2.032,21.59; J2-2 2.032,24.13; J2-3 -0.508,21.59; J2-4 -0.508,24.13; J2-5 -3.048,21.59; J2-6 -3.048,24.13; J2-7 -5.588,21.59; J2-8 -5.588,24.13; J2-9 -8.128,21.59; J2-10 -8.128,24.13; J2-11 -10.668,21.59; J2-12 -10.668,24.13; J2-13 -13.208,21.59; J2-14 -13.208,24.13; J2-15 -15.748,21.59; J2-16 -15.748,24.13; J2-17 -18.288,21.59; J2-18 -18.288,24.13; J2-19 -20.828,21.59; J2-20 -20.828,24.13; J3-1 -11.938,-21.59; J3-2 -11.938,-24.13; J3-3 -9.398,-21.59; J3-4 -9.398,-24.13; J3-5 -6.858,-21.59; J3-6 -6.858,-24.13; J3-7 -4.318,-21.59; J3-8 -4.318,-24.13; J3-9 -1.778,-21.59; J3-10 -1.778,-24.13; J3-11 0.762,-21.59; J3-12 0.762,-24.13; J3-13 3.302,-21.59; J3-14 3.302,-24.13; J3-15 5.842,-21.59; J3-16 5.842,-24.13; J4-1 10.922,-21.59; J4-2 10.922,-24.13; J4-3 13.462,-21.59; J4-4 13.462,-24.13; J4-5 16.002,-21.59; J4-6 16.002,-24.13; J4-7 18.542,-21.59; J4-8 18.542,-24.13; J4-9 21.082,-21.59; J4-10 21.082,-24.13; J4-11 23.622,-21.59; J4-12 23.622,-24.13
STAND-OFF = hole 3.302: 0,0
FIT68-7 = drill 1.1 pad 2.54: P$1 -3.81,0; P$2 3.81,0
TO220V = drill 1.016 long: 1 -2.54,-2.54; 2 0,-2.54; 3 2.54,-2.54
IRFS3006PBF = smd 5.4 x 6.2: D 0,1.23 | smd 1 x 1.6: G -2.28,-6.07; S 2.28,-6.07
MA03-1 = drill 1.016 long: 1 -2.54,0; 2 0,0; 3 2.54,0
DPACK_2 = smd 5.4 x 6.2: D 0,2.5 | smd 1 x 1.6: G -2.28,-4.8; S 2.28,-4.8
DIL28-6 = drill 1 long: 1 -16.51,-7.62; 2 -13.97,-7.62; 3 -11.43,-7.62; 4 -8.89,-7.62; 5 -6.35,-7.62; 6 -3.81,-7.62; 7 -1.27,-7.62; 8 1.27,-7.62; 9 3.81,-7.62; 10 6.35,-7.62; 11 8.89,-7.62; 12 11.43,-7.62; 13 13.97,-7.62; 14 16.51,-7.62; 15 16.51,7.62; 16 13.97,7.62; 17 11.43,7.62; 18 8.89,7.62; 19 6.35,7.62; 20 3.81,7.62; 21 1.27,7.62; 22 -1.27,7.62; 23 -3.81,7.62; 24 -6.35,7.62; 25 -8.89,7.62; 26 -11.43,7.62; 27 -13.97,7.62; 28 -16.51,7.62

### Placement (x,y rotation side)
5VPINS  10.16,86.36 90 top
BOARD2BOARD  252.73,78.74 0 bottom
BUCK  20.32,21.59 0 top
C1  203.2,35.56 180 top
C2  203.2,45.72 180 top
C3  203.2,55.88 180 top
C4  241.3,78.74 0 top
C5  204.47,31.75 270 top
C6  148.59,71.12 0 top
C7  234.95,34.29 270 top
C8  40.64,7.62 90 top
C9  147.32,24.13 180 top
C10  163.83,71.12 0 top
C11  162.56,24.13 180 top
C12  179.07,71.12 0 top
C13  177.8,24.13 180 top
C_BOOST  17.78,33.02 180 top
C_IN  20.32,46.99 0 top
C_IN1  25.4,7.62 90 top
C_IN2  30.48,7.62 90 top
C_IN3  35.56,7.62 90 top
C_OUT  31.75,52.07 0 top
C_OUT1  20.32,39.37 0 top
C_OUT2  20.32,43.18 0 top
CAMERA1  60.96,91.44 0 top
CAMERA2  83.82,91.44 0 top
CONN1  21.59,3.81 90 top
CONN2  240.03,85.09 270 top
CONN3  161.29,0 90 bottom
DEBUGLED1  120.65,74.93 180 top
DEBUGLED2  120.65,67.31 180 top
DEBUGLED3  120.65,59.69 180 top
DEBUGLED4  120.65,52.07 180 top
DEBUGLED5  120.65,44.45 180 top
DEBUGLED6  120.65,36.83 180 top
DRIVER_MCUHALL  250.19,63.5 90 top
ESTOP  224.79,77.47 270 top
GNDPINS  8.89,69.85 90 top
GNDPINS1  179.07,83.82 0 top
HALL_DRIVER  245.11,63.5 270 top
HALLTOMCU  85.09,16.51 0 top
J1  69.04,55.93 180 bottom
JP1  125.73,3.81 0 top
JP2  125.73,93.98 0 top
JP3  3.81,3.81 0 top
JP4  3.81,93.98 90 top
JP5  138.43,90.17 0 top
JP6  138.43,7.62 0 top
JP7  256.54,90.17 0 top
JP8  256.54,6.35 0 top
L1  8.89,45.72 0 top
LINREG  21.59,53.34 0 top
MCUTODRIVER  246.38,46.99 90 top
MCUTOMOTOR  63.5,16.51 0 bottom
Q1  176.53,66.04 0 top
Q2  161.29,66.04 0 top
Q3  146.05,66.04 0 top
Q4  176.53,36.83 0 top
Q5  161.29,36.83 0 top
Q6  146.05,36.83 0 top
R1  203.2,40.64 180 top
R2  203.2,50.8 180 top
R3  203.2,60.96 180 top
R4  203.2,43.18 180 top
R5  203.2,53.34 180 top
R6  203.2,63.5 180 top
R7  176.53,57.15 0 top
R8  161.29,57.15 0 top
R9  146.05,57.15 0 top
R10  176.53,43.18 0 top
R11  161.29,43.18 0 top
R12  146.05,43.18 0 top
RDEAD  236.22,45.72 180 top
RESETMCU  30.48,90.17 90 top
RFAULT  236.22,50.8 180 top
RLED1  106.68,74.93 0 top
RLED2  106.68,67.31 0 top
RLED3  106.68,59.69 0 top
RLED4  106.68,52.07 0 top
RLED5  106.68,44.45 0 top
RLED6  106.68,36.83 0 top
SERVOMOTOR  111.76,90.17 90 top
SV1  102.87,21.59 0 top
SV2  102.87,19.05 0 top
SV3  102.87,16.51 0 top
SV4  102.87,13.97 0 top
SV5  102.87,11.43 0 top
SV6  110.49,21.59 0 top
SV7  110.49,19.05 0 top
SV8  110.49,16.51 0 top
SV9  110.49,13.97 0 top
SV10  110.49,11.43 0 top
SV11  118.11,21.59 0 top
SV12  118.11,19.05 0 top
SV13  118.11,16.51 0 top
SV14  118.11,13.97 0 top
SV15  118.11,11.43 0 top
SV16  223.52,21.59 0 top
SV17  231.14,21.59 0 top
SV18  238.76,21.59 0 top
SV19  223.52,19.05 0 top
SV20  231.14,19.05 0 top
SV21  238.76,19.05 0 top
SV22  223.52,16.51 0 top
SV23  231.14,16.51 0 top
SV24  238.76,16.51 0 top
SV25  223.52,13.97 0 top
SV26  231.14,13.97 0 top
SV27  238.76,13.97 0 top
SV28  223.52,11.43 0 top
SV29  231.14,11.43 0 top
SV30  238.76,11.43 0 top
SV31  149.86,88.9 0 top
SV32  157.48,88.9 0 top
SV33  165.1,88.9 0 top
SV34  149.86,86.36 0 top
SV35  157.48,86.36 0 top
SV36  165.1,86.36 0 top
SV37  149.86,83.82 0 top
SV38  157.48,83.82 0 top
SV39  165.1,83.82 0 top
SV40  149.86,81.28 0 top
SV41  157.48,81.28 0 top
SV42  165.1,81.28 0 top
SV43  149.86,78.74 0 top
SV44  157.48,78.74 0 top
SV45  165.1,78.74 0 top
U$1  36.83,25.4 0 top
U$2  219.71,49.53 270 top
VBATPINS1  7.62,24.13 90 top
VBATPINS2  5.08,24.13 90 top
VBATPINS3  198.12,86.36 0 top
VBATPINS4  198.12,83.82 0 top

### Tracks (layer width: path | path; a pad name or v marks a point on that pad's centre or on a via)
5V  (via drill 1.1)  (1 unrouted)
  Top 0.406: CAMERA2.4 87.63,90.17 87.63,86.36 v88.9,85.09 | 71.12,38.1 72.39,36.83 v72.39,25.4 72.39,24.13 73.66,22.86 90.17,22.86 91.44,21.59 HALLTOMCU.6 | 5VPINS.5 5VPINS.1 | 48.26,82.55 v73.66,82.55 | CAMERA1.4 63.5,92.71 64.77,93.98 v83.82,93.98 | LINREG.3 29.21,50.8 30.48,52.07
  Bottom 0.406: SERVOMOTOR.1 110.49,87.63 v109.22,86.36 107.95,85.09 v88.9,85.09 87.63,85.09 85.09,82.55 v73.66,82.55 | v83.82,93.98 CAMERA2.4
  pour Top: 22.86,60.96 22.86,55.88 24.13,54.61 36.83,54.61 38.1,53.34 38.1,50.8 36.83,49.53 33.02,49.53 44.45,38.1 72.39,38.1 74.93,40.64 74.93,55.88 45.72,85.09 29.21,85.09 27.94,86.36 27.94,93.98 25.4,96.52 11.43,96.52 5.08,90.17 5.08,80.01 6.35,78.74 11.43,78.74 12.7,77.47 12.7,64.77 15.24,62.23 21.59,62.23
  pour Top: 12.7,64.77 12.7,62.23 22.86,52.07 22.86,49.53 24.13,48.26 25.4,48.26 35.56,38.1 46.99,38.1 48.26,39.37 48.26,40.64 46.99,41.91 40.64,41.91 30.48,52.07 30.48,53.34 21.59,62.23 19.05,64.77 17.78,66.04 13.97,66.04
A1  (via drill 1.1)  (1 unrouted)
  Top 0.406: v86.36,21.59 HALLTOMCU.4
  Bottom 0.406: v86.36,21.59 86.36,78.74 85.09,80.01
B1  (via drill 1.1)  (1 unrouted)
  Top 0.406: v83.82,21.59 HALLTOMCU.3
  Bottom 0.406: v83.82,21.59 83.82,78.74 82.55,80.01
BRAKE  (1 unrouted)
  Top 0.406: 48.26,31.75 48.26,27.94 57.15,19.05 MCUTOMOTOR.6
BRAKE1  (via drill 1.1)
  Top 0.406: U$2.25 v233.68,58.42 | ESTOP.2 224.79,71.12 227.33,68.58 232.41,68.58 v233.68,67.31
  Bottom 0.406: v233.68,58.42 234.95,59.69 234.95,66.04 v233.68,67.31
BRAKEN  (via drill 1.1)  (1 unrouted)
  Top 0.406: v240.03,58.42 243.84,54.61 MCUTODRIVER.6 | 229.87,77.47 229.87,72.39 231.14,71.12 237.49,71.12 v238.76,69.85
  Bottom 0.406: v240.03,58.42 240.03,68.58 v238.76,69.85
BUCKEN  (via drill 1.1)  (1 unrouted)
  Top 0.406: 24.13,15.24 25.4,15.24 29.21,19.05 v29.21,24.13
C1  (via drill 1.1)  (1 unrouted)
  Top 0.406: v81.28,21.59 HALLTOMCU.2
  Bottom 0.406: v81.28,21.59 81.28,78.74 80.01,80.01
CA  (1 unrouted)
  Top 0.406: 204.47,35.56 U$2.13
CAMDATA1  (via drill 1.1)  (1 unrouted)
  Top 0.406: CAMERA1.3 60.96,92.71 63.5,95.25 v88.9,95.25 93.98,95.25 96.52,92.71 96.52,87.63 92.71,83.82 92.71,80.01
CAMDATA2  (via drill 1.1)  (1 unrouted)
  Top 0.406: CAMERA2.3 v86.36,93.98 92.71,93.98 93.98,92.71 93.98,87.63 90.17,83.82 90.17,80.01
CB  (via drill 1.1)  (4 unrouted)
  Top 0.406: 19.05,16.51 v19.05,17.78 | 19.05,33.02 v19.05,30.48 | 204.47,45.72 U$2.9
  Bottom 0.406: v19.05,30.48 v19.05,17.78
CC  (1 unrouted)
  Top 0.406: 204.47,55.88 U$2.5
CLK1  (via drill 1.1)  (1 unrouted)
  Top 0.406: 77.47,34.29 78.74,35.56 78.74,57.15 72.39,63.5 72.39,69.85 78.74,76.2 v78.74,83.82 78.74,87.63 77.47,88.9 60.96,88.9 CAMERA1.2
CLK2  (via drill 1.1)  (1 unrouted)
  Top 0.406: CAMERA2.2 81.28,90.17 83.82,87.63 v83.82,83.82 83.82,76.2 77.47,69.85 77.47,63.5 83.82,57.15 83.82,35.56 82.55,34.29
CP1  (1 unrouted)
  Top 0.406: U$2.16 234.95,35.56
CP2  (1 unrouted)
  Top 0.406: U$2.15 234.95,33.02
DIR  (2 unrouted)
  Top 0.406: 50.8,31.75 50.8,27.94 59.69,19.05 MCUTOMOTOR.5 | U$2.24 240.03,55.88 243.84,52.07 MCUTODRIVER.5
DOUT1  (2 unrouted)
  Top 0.406: 87.63,31.75 88.9,30.48 95.25,30.48 96.52,31.75 96.52,67.31 104.14,74.93 105.41,74.93
DOUT2  (2 unrouted)
  Top 0.406: 85.09,31.75 85.09,30.48 86.36,29.21 96.52,29.21 97.79,30.48 97.79,60.96 104.14,67.31 105.41,67.31
DOUT3  (2 unrouted)
  Top 0.406: 82.55,31.75 82.55,29.21 83.82,27.94 97.79,27.94 99.06,29.21 99.06,54.61 104.14,59.69 105.41,59.69
DOUT4  (2 unrouted)
  Top 0.406: 80.01,31.75 80.01,27.94 81.28,26.67 99.06,26.67 100.33,27.94 100.33,48.26 104.14,52.07 105.41,52.07
DOUT5  (2 unrouted)
  Top 0.406: 77.47,31.75 77.47,26.67 78.74,25.4 100.33,25.4 101.6,26.67 101.6,41.91 104.14,44.45 105.41,44.45
DOUT6  (2 unrouted)
  Top 0.406: 74.93,31.75 74.93,25.4 76.2,24.13 101.6,24.13 102.87,25.4 102.87,35.56 104.14,36.83 105.41,36.83
ENABLE  (2 unrouted)
  Top 0.406: 58.42,31.75 58.42,22.86 62.23,19.05 MCUTOMOTOR.4 | U$2.23 240.03,53.34 243.84,49.53 MCUTODRIVER.4
FAULTPIN  (1 unrouted)
  Top 0.406: 234.95,50.8 U$2.22
GHA  (1 unrouted)
  Top 0.406: 204.47,40.64 U$2.11
GHB  (1 unrouted)
  Top 0.406: 204.47,50.8 U$2.7
GHC  (1 unrouted)
  Top 0.406: 204.47,60.96 U$2.3
GLA  (1 unrouted)
  Top 0.406: 204.47,43.18 U$2.10
GLB  (1 unrouted)
  Top 0.406: 204.47,53.34 U$2.6
GLC  (1 unrouted)
  Top 0.406: 204.47,63.5 U$2.2
GND  (via drill 1.1)  (69 unrouted)
  Top 0.406: v33.02,17.78 34.29,19.05 34.29,20.32 39.37,20.32 | v25.4,11.43 25.4,8.89 | v30.48,11.43 30.48,8.89 | v35.56,11.43 35.56,8.89 | v40.64,11.43 40.64,8.89 | 162.56,43.18 163.83,43.18 165.1,41.91 165.1,31.75 163.83,30.48 C11.1 | 177.8,43.18 179.07,43.18 180.34,41.91 180.34,31.75 179.07,30.48 C13.1 | U$2.1 v212.09,77.47 | 237.49,45.72 v240.03,45.72 | C9.1 148.59,30.48 149.86,31.75 149.86,41.91 148.59,43.18 147.32,43.18 | 21.59,46.99 v24.13,46.99 | v35.56,52.07 33.02,52.07
  Top 2.54: C5.2 204.47,26.67 205.74,25.4 v209.55,25.4 | v219.71,82.55 219.71,77.47 | v257.81,78.74 v257.81,71.12 | 243.84,85.09 243.84,80.01 242.57,78.74
  Bottom 0.406: 20.32,12.7 20.32,15.24 | 11.43,6.35 16.51,1.27 46.99,1.27 | 46.99,1.27 73.66,1.27 | 73.66,1.27 116.84,1.27 125.73,10.16 DEBUGLED2.C DEBUGLED1.C | 63.5,85.09 59.69,85.09 CAMERA1.5 | 63.5,85.09 64.77,85.09 | 64.77,85.09 67.31,85.09 72.39,80.01 | 64.77,85.09 69.85,80.01 | 52.07,21.59 52.07,6.35 46.99,1.27 | 63.5,85.09 66.04,87.63 85.09,87.63 | 85.09,87.63 CAMERA2.5 | 85.09,87.63 104.14,87.63 109.22,92.71 SERVOMOTOR.3 | v35.56,52.07 35.56,45.72 | 35.56,43.18 35.56,41.91 | 73.66,1.27 v78.74,6.35 HALLTOMCU.1 | v240.03,45.72 240.03,38.1 | 240.03,38.1 241.3,36.83 246.38,36.83 | GNDPINS.5 GNDPINS.1 | 55.88,26.67 50.8,21.59 | 55.88,31.75 55.88,27.94 54.61,26.67 | U$2.17 240.03,38.1 | GNDPINS1.1 GNDPINS1.5 | 208.28,80.01 213.36,80.01 | 209.55,81.28 209.55,77.47 | 209.55,77.47 209.55,76.2 | 210.82,82.55 210.82,76.2 | 212.09,82.55 212.09,76.2 | 213.36,82.55 213.36,76.2 | 214.63,77.47 209.55,77.47 | 214.63,78.74 208.28,78.74 | DRIVER_MCUHALL.6 256.54,69.85 | HALL_DRIVER.1 259.08,69.85
  Bottom 2.54: v209.55,25.4 213.36,29.21 240.03,29.21 257.81,46.99 v257.81,71.12 | v257.81,78.74 254,82.55 246.38,82.55 240.03,88.9 222.25,88.9 213.36,80.01 v212.09,78.74 | 219.71,85.09 v219.71,82.55
  other vias: 212.09,80.01
  pour Bottom: 20.32,12.7 12.7,5.08 11.43,3.81 11.43,2.54 12.7,1.27 13.97,1.27 20.32,7.62 41.91,7.62 43.18,8.89 43.18,11.43 41.91,12.7 40.64,13.97 21.59,13.97
  pour Bottom: 6.35,55.88 7.62,54.61 10.16,54.61 11.43,55.88 11.43,68.58 10.16,69.85 7.62,69.85 6.35,68.58
  pour Bottom: 22.86,53.34 25.4,55.88 34.29,55.88 35.56,54.61 35.56,41.91 34.29,40.64 31.75,40.64 29.21,43.18 21.59,43.18 20.32,44.45 20.32,48.26 22.86,50.8
  pour Bottom: 12.7,1.27 5.08,8.89 5.08,44.45 6.35,45.72 25.4,45.72 27.94,43.18 31.75,43.18 33.02,41.91 33.02,40.64 31.75,39.37 25.4,39.37 21.59,35.56 16.51,35.56 13.97,33.02 13.97,13.97 15.24,12.7 20.32,12.7 20.32,7.62 13.97,1.27
  pour Bottom: 13.97,1.27 17.78,1.27 17.78,2.54 22.86,7.62 22.86,8.89 21.59,10.16 20.32,10.16 19.05,8.89 13.97,3.81 12.7,3.81 11.43,2.54 12.7,1.27
  pour Bottom: 5.08,39.37 5.08,90.17 11.43,96.52 72.39,96.52 76.2,92.71 76.2,90.17 71.12,85.09 54.61,85.09 45.72,76.2 45.72,67.31 35.56,57.15 35.56,54.61 34.29,53.34 33.02,53.34 22.86,43.18 19.05,43.18 13.97,38.1 6.35,38.1
  pour Bottom: 34.29,40.64 60.96,40.64 63.5,43.18 63.5,73.66 62.23,74.93 57.15,74.93 54.61,77.47 54.61,82.55 57.15,85.09 57.15,86.36 55.88,86.36 45.72,76.2 45.72,67.31 34.29,55.88
  pour Bottom: 12.7,1.27 116.84,1.27 127,11.43 127,74.93 125.73,76.2 119.38,76.2 118.11,74.93 118.11,26.67 123.19,21.59 123.19,10.16 116.84,3.81 76.2,3.81 71.12,8.89 57.15,8.89 53.34,12.7 53.34,20.32 52.07,21.59 41.91,21.59 40.64,20.32 40.64,15.24 39.37,13.97 21.59,13.97 11.43,3.81 11.43,2.54
  pour Bottom: 33.02,17.78 33.02,20.32 34.29,21.59 41.91,21.59 43.18,20.32 43.18,16.51 39.37,12.7 31.75,12.7 30.48,13.97 30.48,16.51 31.75,17.78
  pour Bottom: 27.94,13.97 29.21,12.7 31.75,12.7 33.02,13.97 33.02,15.24 31.75,16.51 30.48,16.51 30.48,15.24 29.21,13.97
  pour Bottom: 33.02,19.05 31.75,17.78 33.02,17.78
  pour Bottom: 71.12,8.89 121.92,8.89 121.92,6.35 116.84,1.27 78.74,1.27
  pour Bottom: 41.91,21.59 43.18,21.59 48.26,26.67 55.88,26.67 57.15,25.4 57.15,24.13 55.88,22.86 54.61,21.59 54.61,11.43 52.07,11.43
  pour Bottom: 212.09,30.48 207.01,25.4 207.01,24.13 208.28,22.86 210.82,22.86 214.63,26.67 242.57,26.67 259.08,43.18 259.08,72.39 255.27,72.39 254,71.12 254,45.72 250.19,39.37 237.49,39.37 237.49,31.75 234.95,30.48
  pour Bottom: 209.55,66.04 210.82,64.77 213.36,64.77 214.63,66.04 214.63,68.58 222.25,76.2 222.25,82.55 227.33,87.63 240.03,87.63 241.3,86.36 241.3,81.28 243.84,78.74 254,78.74 255.27,80.01 255.27,83.82 254,85.09 247.65,85.09 246.38,85.09 238.76,92.71 209.55,92.71 208.28,91.44 208.28,67.31
  pour Bottom: 171.45,85.09 172.72,86.36 185.42,86.36 186.69,85.09 191.77,80.01 205.74,80.01 208.28,82.55 213.36,82.55 214.63,82.55 215.9,81.28 215.9,74.93 214.63,73.66 186.69,73.66 184.15,76.2 172.72,76.2 171.45,77.47
  pour Bottom: 76.2,90.17 77.47,88.9 86.36,88.9 87.63,90.17 87.63,92.71 88.9,93.98 109.22,93.98 110.49,95.25 113.03,95.25 114.3,93.98 114.3,92.71 113.03,91.44 107.95,91.44 104.14,87.63 102.87,86.36 86.36,86.36 85.09,85.09 71.12,85.09 69.85,86.36 69.85,88.9 71.12,90.17
  pour Bottom: 113.03,95.25 119.38,95.25 127,87.63 127,74.93 127,73.66 125.73,72.39 119.38,72.39 118.11,73.66 118.11,86.36 113.03,91.44 110.49,91.44 109.22,92.71 109.22,93.98 110.49,95.25
HALL_A  (1 unrouted)
  Top 0.406: U$2.26 238.76,60.96 242.57,62.23 HALL_DRIVER.4
HALL_B  (1 unrouted)
  Top 0.406: U$2.27 238.76,63.5 242.57,64.77 HALL_DRIVER.3
HALL_C  (1 unrouted)
  Top 0.406: U$2.28 238.76,66.04 242.57,67.31 HALL_DRIVER.2
N$1
  Top 0.406: RLED2.2 DEBUGLED2.A
N$2
  Top 0.406: RLED3.2 DEBUGLED3.A
N$3
  Top 0.406: RLED4.2 DEBUGLED4.A
N$4
  Top 0.406: RLED5.2 DEBUGLED5.A
N$5
  Top 0.406: RLED6.2 DEBUGLED6.A
N$6  (via drill 1.1)  (1 unrouted)
  Top 0.406: RESETMCU.2 34.29,86.36 55.88,86.36 v58.42,83.82
  Bottom 0.406: v58.42,83.82 62.23,80.01
N$7
  Top 0.406: RLED1.2 DEBUGLED1.A
N$8  (via drill 1.1)  (3 unrouted)
  Top 0.406: 175.26,57.15 173.99,58.42 173.99,59.69 | 201.93,40.64 v198.12,40.64 | 173.99,59.69 173.99,60.96 | v171.45,62.23 173.99,59.69 | v182.88,59.69 v182.88,52.07
  Bottom 0.406: v171.45,62.23 171.45,69.85 173.99,72.39 181.61,72.39 182.88,71.12 v182.88,59.69 | v198.12,40.64 194.31,40.64 v182.88,52.07
N$9  (3 unrouted)
  Top 0.406: 175.26,43.18 173.99,43.18 172.72,41.91 172.72,31.75 173.99,30.48 172.72,30.48 171.45,31.75 171.45,43.18 172.72,44.45 180.34,44.45 181.61,43.18 198.12,43.18 199.39,43.18 201.93,43.18
N$10
  pour Bottom: 29.21,13.97 30.48,13.97 30.48,15.24
N$11  (via drill 1.1)  (3 unrouted)
  Top 0.406: 160.02,57.15 158.75,58.42 158.75,59.69 v156.21,62.23 | 201.93,50.8 v198.12,50.8 | v184.15,62.23 v184.15,54.61
  Bottom 0.406: v156.21,62.23 156.21,71.12 158.75,73.66 182.88,73.66 184.15,72.39 v184.15,62.23 | v198.12,50.8 187.96,50.8 v184.15,54.61
N$12  (3 unrouted)
  Top 0.406: 160.02,43.18 158.75,43.18 157.48,41.91 157.48,31.75 158.75,30.48 156.21,30.48 154.94,31.75 154.94,43.18 157.48,45.72 182.88,45.72 190.5,53.34 201.93,53.34
N$14  (3 unrouted)
  Top 0.406: 144.78,43.18 143.51,43.18 142.24,41.91 142.24,31.75 143.51,30.48 139.7,30.48 138.43,31.75 138.43,41.91 143.51,46.99 180.34,46.99 196.85,63.5 201.93,63.5
N$15  (via drill 1.1)  (3 unrouted)
  Top 0.406: 144.78,57.15 143.51,58.42 143.51,59.69 v140.97,62.23 | 201.93,60.96 v198.12,60.96
  Bottom 0.406: v140.97,62.23 140.97,72.39 143.51,74.93 184.15,74.93 185.42,73.66 185.42,64.77 189.23,60.96 v198.12,60.96
N$30  (via drill 1.1)
  other vias: 213.36,77.47
N$31  (via drill 1.1)
  other vias: 213.36,78.74
N$33  (via drill 1.1)
  other vias: 210.82,78.74
N$34  (via drill 1.1)
  other vias: 210.82,77.47
N$35  (via drill 1.1)
  other vias: 209.55,77.47
N$36  (via drill 1.1)
  other vias: 209.55,78.74
N$37  (via drill 1.1)
  other vias: 209.55,80.01
N$38  (via drill 1.1)
  other vias: 210.82,80.01
N$40  (via drill 1.1)
  other vias: 213.36,80.01
OUT_A  (via drill 1.1)  (6 unrouted)
  Top 0.406: 177.8,57.15 179.07,58.42 179.07,59.69 181.61,62.23 181.61,69.85 C12.2 | C13.2 176.53,25.4 | U$2.12 203.2,38.1 201.93,36.83 201.93,35.56
  Top 0.813: 201.93,35.56 194.31,35.56 176.53,17.78
  Top 2.54: 176.53,35.56 v176.53,27.94 C13.2 176.53,17.78 168.91,10.16 | 177.8,57.15 177.8,54.61 v176.53,53.34
  Bottom 2.54: v176.53,53.34 167.64,44.45 167.64,30.48 170.18,27.94 v176.53,27.94
OUT_B  (via drill 1.1)  (7 unrouted)
  Top 0.406: 162.56,57.15 163.83,58.42 163.83,59.69 166.37,62.23 166.37,69.85 C10.2 | U$2.8 203.2,48.26 201.93,46.99 201.93,45.72
  Top 0.813: v156.21,48.26 v177.8,48.26 | v185.42,45.72 201.93,45.72
  Top 2.54: 161.29,35.56 v161.29,27.94 161.29,10.16 | 162.56,57.15 162.56,54.61 v161.29,53.34
  Bottom 0.813: v177.8,48.26 182.88,48.26 v185.42,45.72
  Bottom 2.54: v161.29,53.34 v156.21,48.26 152.4,44.45 152.4,30.48 154.94,27.94 v161.29,27.94
OUT_C  (via drill 1.1)  (7 unrouted)
  Top 0.406: 147.32,57.15 148.59,58.42 148.59,59.69 151.13,62.23 151.13,69.85 C6.2 | U$2.4 203.2,58.42 201.93,57.15 201.93,55.88
  Top 0.813: v142.24,49.53 147.32,49.53 148.59,50.8 177.8,50.8 181.61,54.61 v181.61,55.88 | v198.12,55.88 201.93,55.88
  Top 2.54: 146.05,35.56 v146.05,27.94 146.05,17.78 153.67,10.16 | 147.32,57.15 147.32,54.61 v146.05,53.34
  Bottom 0.813: v181.61,55.88 184.15,58.42 195.58,58.42 v198.12,55.88
  Bottom 2.54: v146.05,53.34 v142.24,49.53 135.89,43.18 135.89,30.48 138.43,27.94 v146.05,27.94
SERVOPWM  (via drill 1.1)  (1 unrouted)
  Top 0.406: v78.74,67.31 90.17,67.31 v105.41,82.55 105.41,86.36 109.22,90.17 SERVOMOTOR.2
  Bottom 0.406: 68.58,31.75 67.31,33.02 67.31,66.04 68.58,67.31 v78.74,67.31
SI1  (via drill 1.1)  (1 unrouted)
  Top 0.406: 74.93,34.29 76.2,35.56 76.2,57.15 69.85,63.5 69.85,69.85 76.2,76.2 v76.2,83.82 76.2,86.36 74.93,87.63 59.69,87.63 CAMERA1.1
SI2  (via drill 1.1)  (1 unrouted)
  Top 0.406: CAMERA2.1 78.74,90.17 81.28,87.63 v81.28,83.82 81.28,76.2 74.93,69.85 74.93,63.5 81.28,57.15 81.28,35.56 80.01,34.29
SPEEDPIN  (3 unrouted)
  Top 0.406: 66.04,31.75 66.04,22.86 69.85,19.05 MCUTOMOTOR.1 | U$2.19 233.68,43.18
TDEAD
  Top 0.406: U$2.20 234.95,45.72
TEMP1  (via drill 1.1)  (1 unrouted)
  Top 0.406: v88.9,21.59 HALLTOMCU.5
  Bottom 0.406: v88.9,21.59 88.9,78.74 87.63,80.01
VBAT  (via drill 1.1)  (3 unrouted)
  Top 0.406: 17.78,15.24 17.78,10.16 | VBATPINS2.5 VBATPINS2.1 | VBATPINS1.5 VBATPINS1.1 | VBATPINS3.1 VBATPINS3.5 | VBATPINS4.1 VBATPINS4.5
  Top 2.54: 236.22,85.09 236.22,81.28 | 236.22,81.28 238.76,78.74 | 236.22,81.28 v236.22,76.2 237.49,74.93 252.73,74.93
  Bottom 2.54: v236.22,76.2 229.87,69.85 220.98,69.85 219.71,68.58 219.71,43.18 222.25,40.64 U$2.18
  pour Top: 3.81,30.48 2.54,29.21 2.54,19.05 19.05,2.54 41.91,2.54 43.18,3.81 43.18,6.35 41.91,7.62 20.32,7.62 10.16,17.78 10.16,29.21 8.89,30.48
  pour Top: 251.46,77.47 252.73,76.2 252.73,72.39 237.49,72.39 233.68,76.2 233.68,86.36 234.95,87.63 237.49,87.63 238.76,86.36 238.76,81.28 240.03,80.01 240.03,78.74 242.57,76.2 243.84,76.2 245.11,77.47
  pour Top: 193.04,88.9 190.5,86.36 190.5,83.82 193.04,81.28 204.47,81.28 208.28,85.09 232.41,85.09 234.95,82.55 237.49,82.55 238.76,83.82 238.76,86.36 231.14,93.98 198.12,93.98
VBB  (5 unrouted)
  Top 0.406: C10.1 161.29,69.85 | C6.1 146.05,69.85 | C12.1 176.53,69.85
VDD  (3 unrouted)
  Top 0.406: 63.5,31.75 63.5,22.86 67.31,19.05 MCUTOMOTOR.2 | U$2.21 240.03,48.26 243.84,44.45 MCUTODRIVER.2
VFAULT  (3 unrouted)
  Top 0.406: 60.96,31.75 60.96,22.86 64.77,19.05 MCUTOMOTOR.3 | 237.49,50.8 240.03,50.8 243.84,46.99 MCUTODRIVER.3
VINLINREG  (via drill 1.1)  (1 unrouted)
  Top 0.406: 22.86,16.51 v22.86,17.78 | v22.86,30.48 22.86,34.29 20.32,36.83 17.78,36.83 12.7,41.91 L1.P$2
  Bottom 0.406: v22.86,30.48 v22.86,17.78
  pour Top: 17.78,36.83 8.89,45.72 8.89,52.07 10.16,53.34 19.05,53.34 20.32,52.07 20.32,48.26 19.05,46.99 19.05,45.72 20.32,44.45 20.32,38.1 19.05,36.83
VREG
  Top 0.406: C5.1 U$2.14
VSW  (via drill 1.1)  (1 unrouted)
  Top 0.406: 16.51,16.51 v16.51,17.78 | v16.51,30.48 16.51,33.02 5.08,44.45 L1.P$1 15.24,35.56 19.05,35.56 v21.59,33.02 | v31.75,24.13 33.02,22.86 35.56,22.86 36.83,24.13 36.83,25.4
  Bottom 0.406: v16.51,30.48 v16.51,17.78 | v21.59,33.02 22.86,33.02 v31.75,24.13
  pour Top: 7.62,45.72 7.62,46.99 6.35,48.26 3.81,48.26 2.54,46.99 2.54,44.45 2.54,41.91 12.7,31.75 15.24,31.75 16.51,33.02 17.78,34.29 17.78,35.56

### Text on the board
Dimension: Team 3 | Andrew Chan | Neeli Tummala | Juan Rodriguez
_bsilk: CUT HERE --- CUT HERE --- CUT HERE | CUT HERE --- CUT HERE --- CUT HERE